# Altium schematic sheet LEDs_FMU3_REV_C.SchDoc: Pixhawk_mini_8L.sch
size A4; Date: 18/08/2014 1:53:21 PM; DrawnBy: Philip Rowse; SheetNumber: 6; SheetTotal: 10
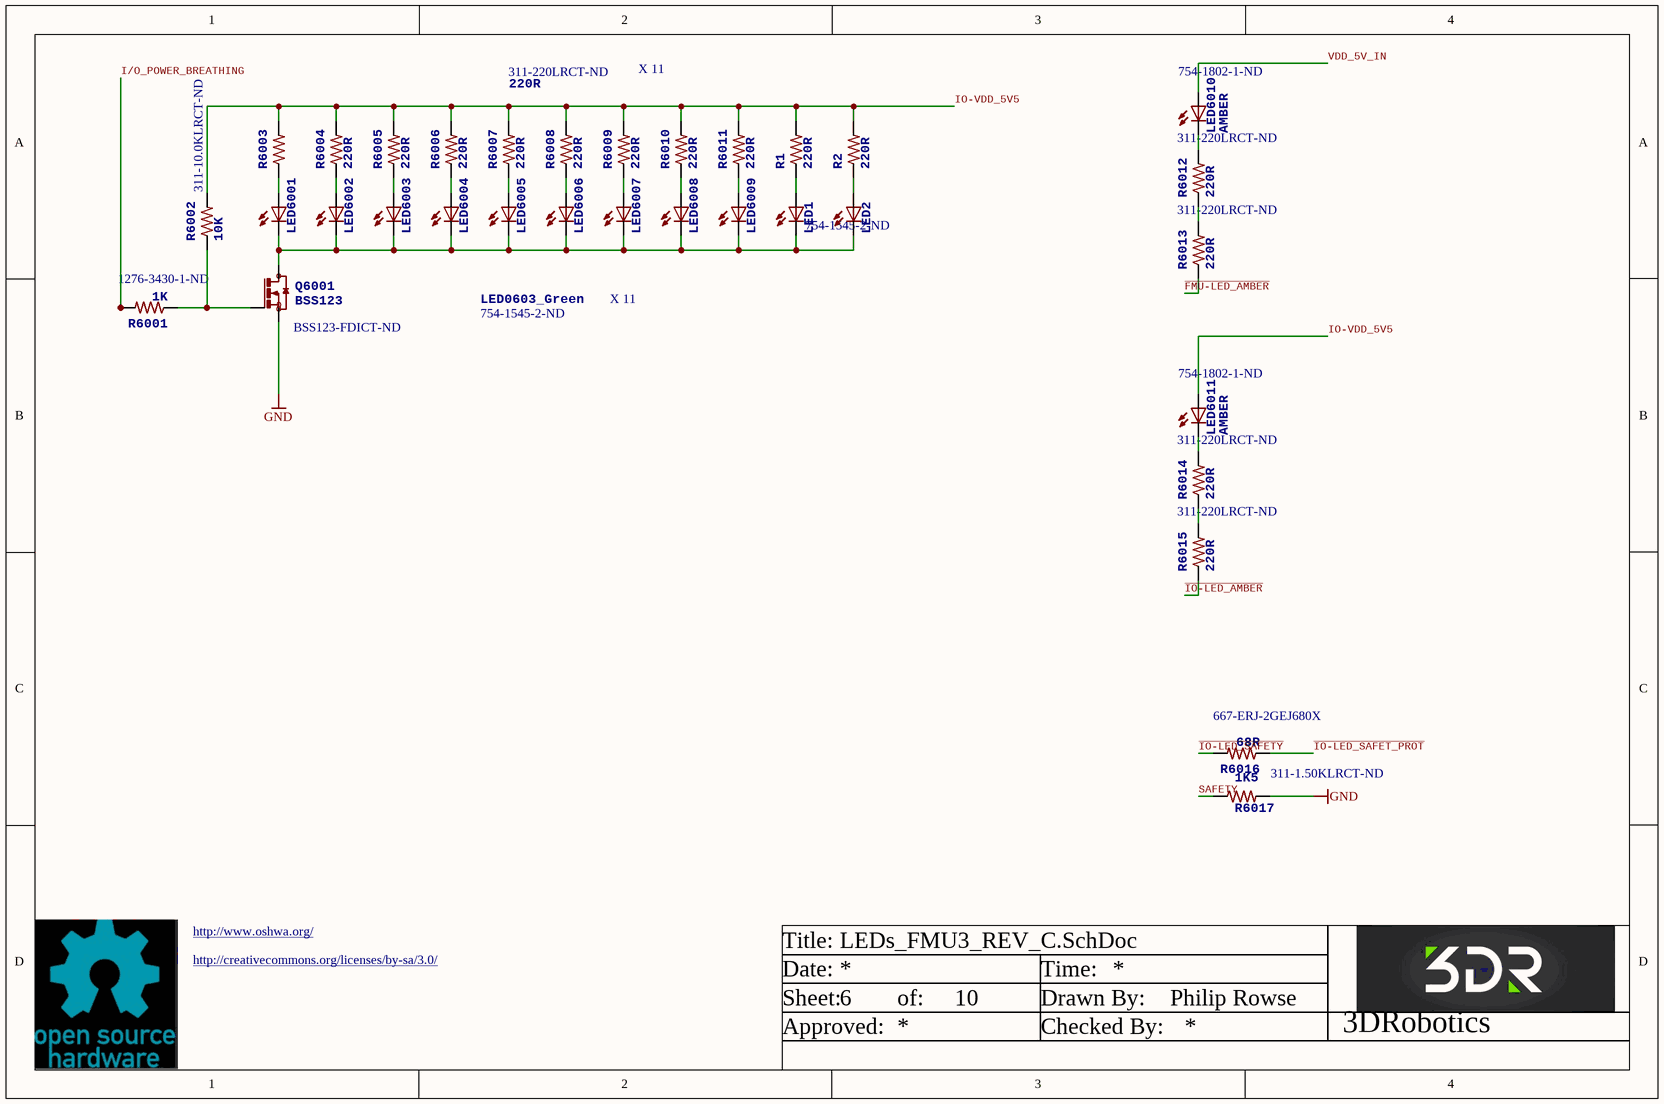
[diagram p0: LEDs_FMU3_REV_C.SchDoc]

## Parts
LED1  Supplier Part Number 1: 754-1545-2-ND  [0603-LED-Blue]  (hidden comment: LED0603_Green)
LED2  LED0603_Green  [0603-LED-Blue]  (value not drawn)
LED6001  LED0603_Green  Supplier Part Number 1: 754-1545-2-ND  [0603-LED-Blue]
LED6002  LED0603_Green  [0603-LED-Blue]  (value not drawn)
LED6003  LED0603_Green  [0603-LED-Blue]  (value not drawn)
LED6004  LED0603_Green  [0603-LED-Blue]  (value not drawn)
LED6005  LED0603_Green  [0603-LED-Blue]  (value not drawn)
LED6006  LED0603_Green  [0603-LED-Blue]  (value not drawn)
LED6007  LED0603_Green  [0603-LED-Blue]  (value not drawn)
LED6008  LED0603_Green  [0603-LED-Blue]  (value not drawn)
LED6009  LED0603_Green  [0603-LED-Blue]  (value not drawn)
LED6010  AMBER  Supplier Part Number 1: 754-1802-1-ND  [0603-LED]
LED6011  AMBER  Supplier Part Number 1: 754-1802-1-ND  [0603-LED]
Q6001  BSS123  Supplier Part Number 1: BSS123-FDICT-ND  [SOT23]
R1  220R  [0402-RES]
R2  220R  [0402-RES]
R6001  1K  Supplier Part Number 1: 1276-3430-1-ND  [0402-RES]
R6002  10K  Supplier Part Number 1: 311-10.0KLRCT-ND  [0402-RES]
R6003  220R  Supplier Part Number 1: 311-220LRCT-ND  [0402-RES]
R6004  220R  [0402-RES]
R6005  220R  [0402-RES]
R6006  220R  [0402-RES]
R6007  220R  [0402-RES]
R6008  220R  [0402-RES]
R6009  220R  [0402-RES]
R6010  220R  [0402-RES]
R6011  220R  [0402-RES]
R6012  220R  Supplier Part Number 1: 311-220LRCT-ND  [0402-RES]
R6013  220R  Supplier Part Number 1: 311-220LRCT-ND  [0402-RES]
R6014  220R  Supplier Part Number 1: 311-220LRCT-ND  [0402-RES]
R6015  220R  Supplier Part Number 1: 311-220LRCT-ND  [0402-RES]
R6016  68R  Supplier Part Number 1: 667-ERJ-2GEJ680X  [0402-RES]
R6017  1K5  Supplier Part Number 1: 311-1.50KLRCT-ND  [0402-RES]

## Nets
GND: Q6001.2(S) R6017.P$2
~{FMU-LED_AMBER}: R6013.P$1
I/O_POWER_BREATHING: R6001.P$2
~{IO-LED_AMBER}: R6015.P$1
~{IO-LED_SAFET_PROT}: R6016.P$1
~{IO-LED_SAFETY}: R6016.P$2
IO-VDD_5V5: LED6011.A R1.P$2 R2.P$2 R6002.P$2 R6003.P$2 R6004.P$2 R6005.P$2 R6006.P$2 R6007.P$2 R6008.P$2 R6009.P$2 R6010.P$2 R6011.P$2
SAFETY: R6017.P$1
VDD_5V_IN: LED6010.A
NetLED1_A: LED1.A R1.P$1
NetLED1_C: LED1.C LED2.C LED6001.C LED6002.C LED6003.C LED6004.C LED6005.C LED6006.C LED6007.C LED6008.C LED6009.C Q6001.3(D)
NetLED2_A: LED2.A R2.P$1
NetLED6001_A: LED6001.A R6003.P$1
NetLED6002_A: LED6002.A R6004.P$1
NetLED6003_A: LED6003.A R6005.P$1
NetLED6004_A: LED6004.A R6006.P$1
NetLED6005_A: LED6005.A R6007.P$1
NetLED6006_A: LED6006.A R6008.P$1
NetLED6007_A: LED6007.A R6009.P$1
NetLED6008_A: LED6008.A R6010.P$1
NetLED6009_A: LED6009.A R6011.P$1
NetLED6010_C: LED6010.C R6012.P$2
NetLED6011_C: LED6011.C R6014.P$2
NetQ6001_1: Q6001.1(G) R6001.P$1 R6002.P$1
NetR6012_P$1: R6012.P$1 R6013.P$2
NetR6014_P$1: R6014.P$1 R6015.P$2

## Notes on the sheet
- X 11
- http://www.oshwa.org/
- http://creativecommons.org/licenses/by-sa/3.0/
- Title:
- Date:
- Time:
- Sheet:
- Approved:
- of:
- Drawn By:
- Checked By:
- 3DRobotics

## Library data of the parts
LED1 LED2 LED6001-LED6009 = LED0603_Blue: LED GREEN ROUND CLEAR SMD; 3DR_PARTNO: ECM0494; PARTNO: APTD1608CGCK; Supplier 1: Digi-Key; Value: GREEN
  LED2 LED6002-LED6009: Supplier Part Number 1: 754-1545-2-ND
LED6010 LED6011 = LED0603: LED 1.6X0.8 DOME ORN CLEAR SMD; PARTNO: APTD1608SECK; 3DR_PARTNO: ECM0515; Supplier 1: Digi-Key; Value: AMBER
Q6001 = BSS123: MOSFET N-CH 100V 170MA SOT23-3; 3DR_PARTNO: ECM0547; PARTNO: BSS123; Supplier 1: Digi-Key; Value: 100V
R1 R2 R6003-R6015 = RESISTOR0402-RES: RES 220 OHM 1/16W 1% 0402 SMD; PARTNO: RC0402FR-07220RL; 3DR_PARTNO: ECM0821; Supplier 1: Digi-Key; Value: 220R
  R1 R2 R6004-R6011: Supplier Part Number 1: 311-220LRCT-ND
R6001 = RESISTOR0402-RES: RES 1K OHM 1/16W 1% 0402; PARTNO: RC1005F102CS; 3DR_PARTNO: ECM0804; Supplier 1: Digi-Key; Value: 1K
R6002 = RESISTOR0402-RES: RES 10K OHM 1/16W 1% 0402 SMD; PARTNO: RC0402FR-0710KL; 3DR_PARTNO: ECM0800; Supplier 1: Digi-Key; Value: 10K
R6016 = RESISTOR0402-RES: Thick Film Resistors - SMD 0402 68ohms 5% Tol; PARTNO: ERJ-2GEJ680X; 3DR_PARTNO: ECM0816; Supplier 1: Mouser; Value: 68R
R6017 = RESISTOR0402-RES: RES 1.5K OHM 1/16W 1% 0402 SMD; 3DR_PARTNO: ECM0803; PARTNO: RC0402FR-071K5L; Supplier 1: Digi-Key; Value: 1K5